# EAGLE design EPS Flatsat Module2 (EAGLE 9.2.0)

## Sheet 1 of 3
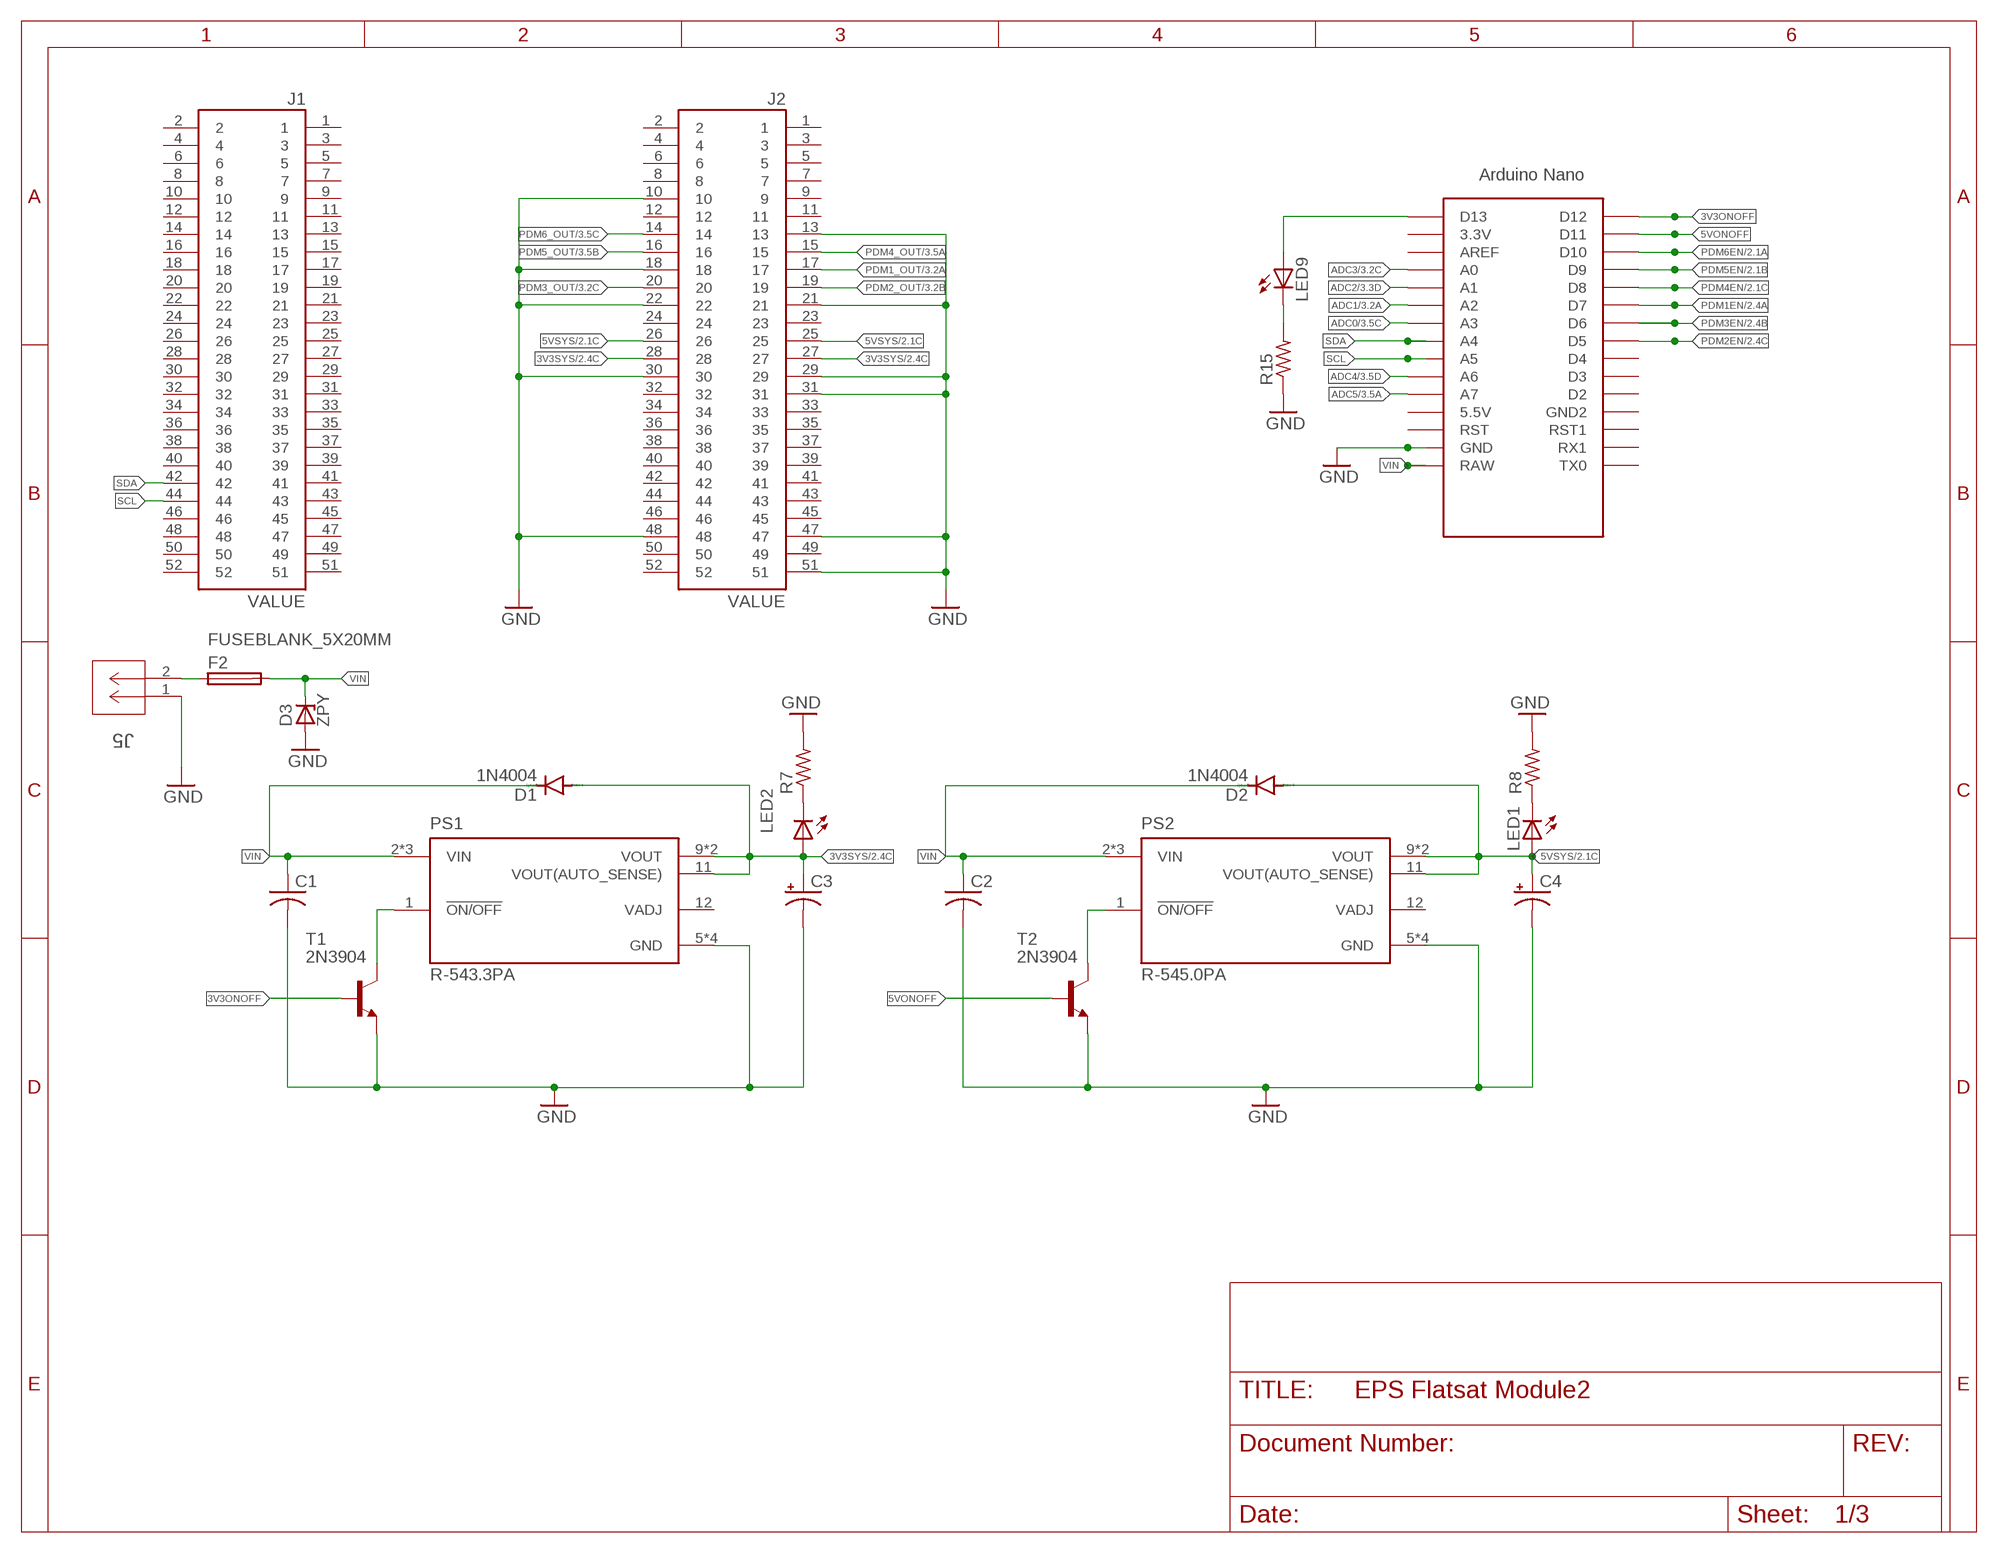
[diagram p0: schematic, sheet 1]

### Parts
C1  C-USC0805  [C0805]
C2  C-USC0805  [C0805]
C3  CPOL-USE2.5-6  [E2,5-6]
C4  CPOL-USE2.5-6  [E2,5-6]
D1  1N4004  [DO41-10]
D2  1N4004  [DO41-10]
D3  ZPY  [DO41Z10]
F2  FUSEBLANK_5X20MM  [FUSE_HOLDER_5X20MM]
J1  ESQ-126-39-G-D  [SAMTEC_ESQ-126-39-G-D]
J2  ESQ-126-39-G-D  [SAMTEC_ESQ-126-39-G-D]
J5  1985881  [CONN_1715022_PXC]
LED1  LEDCHIPLED_0805  [CHIPLED_0805]
LED2  LEDCHIPLED_0805  [CHIPLED_0805]
LED9  LEDCHIP-LED0805  [CHIP-LED0805]
PS1  R-543.3PA  [CONV_R-543.3PA]
PS2  R-545.0PA  [CONV_R-545.0PA]
R7  R-US_R0805  [R0805]
R8  R-US_R0805  [R0805]
R15  R-US_R0805  [R0805]
T1  2N3904  [TO92]
T2  2N3904  [TO92]
U$1  NANO  [NANO]

### Nets
3V3ONOFF: T1.2(B) U$1.D12
3V3SYS [power]: C3.+ D1.A J2.27 J2.28 LED2.A PS1.9(VOUT) PS1.10(VOUT) PS1.11(VOUT(AUTO_SENSE)) ; also sheet 2
5VONOFF: T2.2(B) U$1.D11
5VSYS [power]: C4.+ D2.A J2.25 J2.26 LED1.A PS2.9(VOUT) PS2.10(VOUT) PS2.11(VOUT(AUTO_SENSE)) ; also sheet 2
ADC0: U$1.A3 ; also sheet 3
ADC1: U$1.A2 ; also sheet 3
ADC2: U$1.A1 ; also sheet 3
ADC3: U$1.A0 ; also sheet 3
ADC4: U$1.A6 ; also sheet 3
ADC5: U$1.A7 ; also sheet 3
GND [power]: C1.2 C2.2 C3.- C4.- D3.A J2.10 J2.13 J2.18 J2.21 J2.22 J2.29 J2.30 J2.31 J2.47 J2.48 J2.51 J5.1 PS1.5(GND) PS1.6(GND) PS1.7(GND) PS1.8(GND) PS2.5(GND) PS2.6(GND) PS2.7(GND) PS2.8(GND) R7.2 R8.2 R15.1 T1.3(E) T2.3(E) U$1.GND ; also sheet 2,3
N$1: PS1.1(!ON/OFF) T1.1(C)
N$2: PS2.1(!ON/OFF) T2.1(C)
N$9: LED1.C R8.1
N$10: LED2.C R7.1
N$17 [power]: F2.1 J5.2
N$18: LED9.A U$1.D13
N$27: LED9.C R15.2
PDM1_OUT: J2.17 ; also sheet 3
PDM1EN: U$1.D7 ; also sheet 2
PDM2_OUT: J2.19 ; also sheet 3
PDM2EN: U$1.D5 ; also sheet 2
PDM3_OUT: J2.20 ; also sheet 3
PDM3EN: U$1.D6 ; also sheet 2
PDM4_OUT: J2.15 ; also sheet 3
PDM4EN: U$1.D8 ; also sheet 2
PDM5_OUT: J2.16 ; also sheet 3
PDM5EN: U$1.D9 ; also sheet 2
PDM6_OUT: J2.14 ; also sheet 3
PDM6EN: U$1.D10 ; also sheet 2
SCL: J1.44 U$1.A5
SDA: J1.42 U$1.A4
VIN [power]: C1.1 C2.1 D1.C D2.C D3.C F2.2 PS1.2(VIN) PS1.3(VIN) PS1.4(VIN) PS2.2(VIN) PS2.3(VIN) PS2.4(VIN) U$1.RAW
Unconnected: J1.1 J1.2 J1.3 J1.4 J1.5 J1.6 J1.7 J1.8 J1.9 J1.10 J1.11 J1.12 J1.13 J1.14 J1.15 J1.16 J1.17 J1.18 J1.19 J1.20 J1.21 J1.22 J1.23 J1.24 J1.25 J1.26 J1.27 J1.28 J1.29 J1.30 J1.31 J1.32 J1.33 J1.34 J1.35 J1.36 J1.37 J1.38 J1.39 J1.40 J1.41 J1.43 J1.45 J1.46 J1.47 J1.48 J1.49 J1.50 J1.51 J1.52 J2.1 J2.2 J2.3 J2.4 J2.5 J2.6 J2.7 J2.8 J2.9 J2.11 J2.12 J2.23 J2.24 J2.32 J2.33 J2.34 J2.35 J2.36 J2.37 J2.38 J2.39 J2.40 J2.41 J2.42 J2.43 J2.44 J2.45 J2.46 J2.49 J2.50 J2.52 PS1.12(VADJ) PS2.12(VADJ) U$1.3.3V U$1.5V(5.5V) U$1.AREF U$1.D2 U$1.D3 U$1.D4 U$1.GND1(GND2) U$1.ICSP1 U$1.ICSP2 U$1.ICSP3 U$1.ICSP4 U$1.ICSP5 U$1.ICSP6 U$1.RST U$1.RST1 U$1.RX1 U$1.TX0

## Sheet 2 of 3
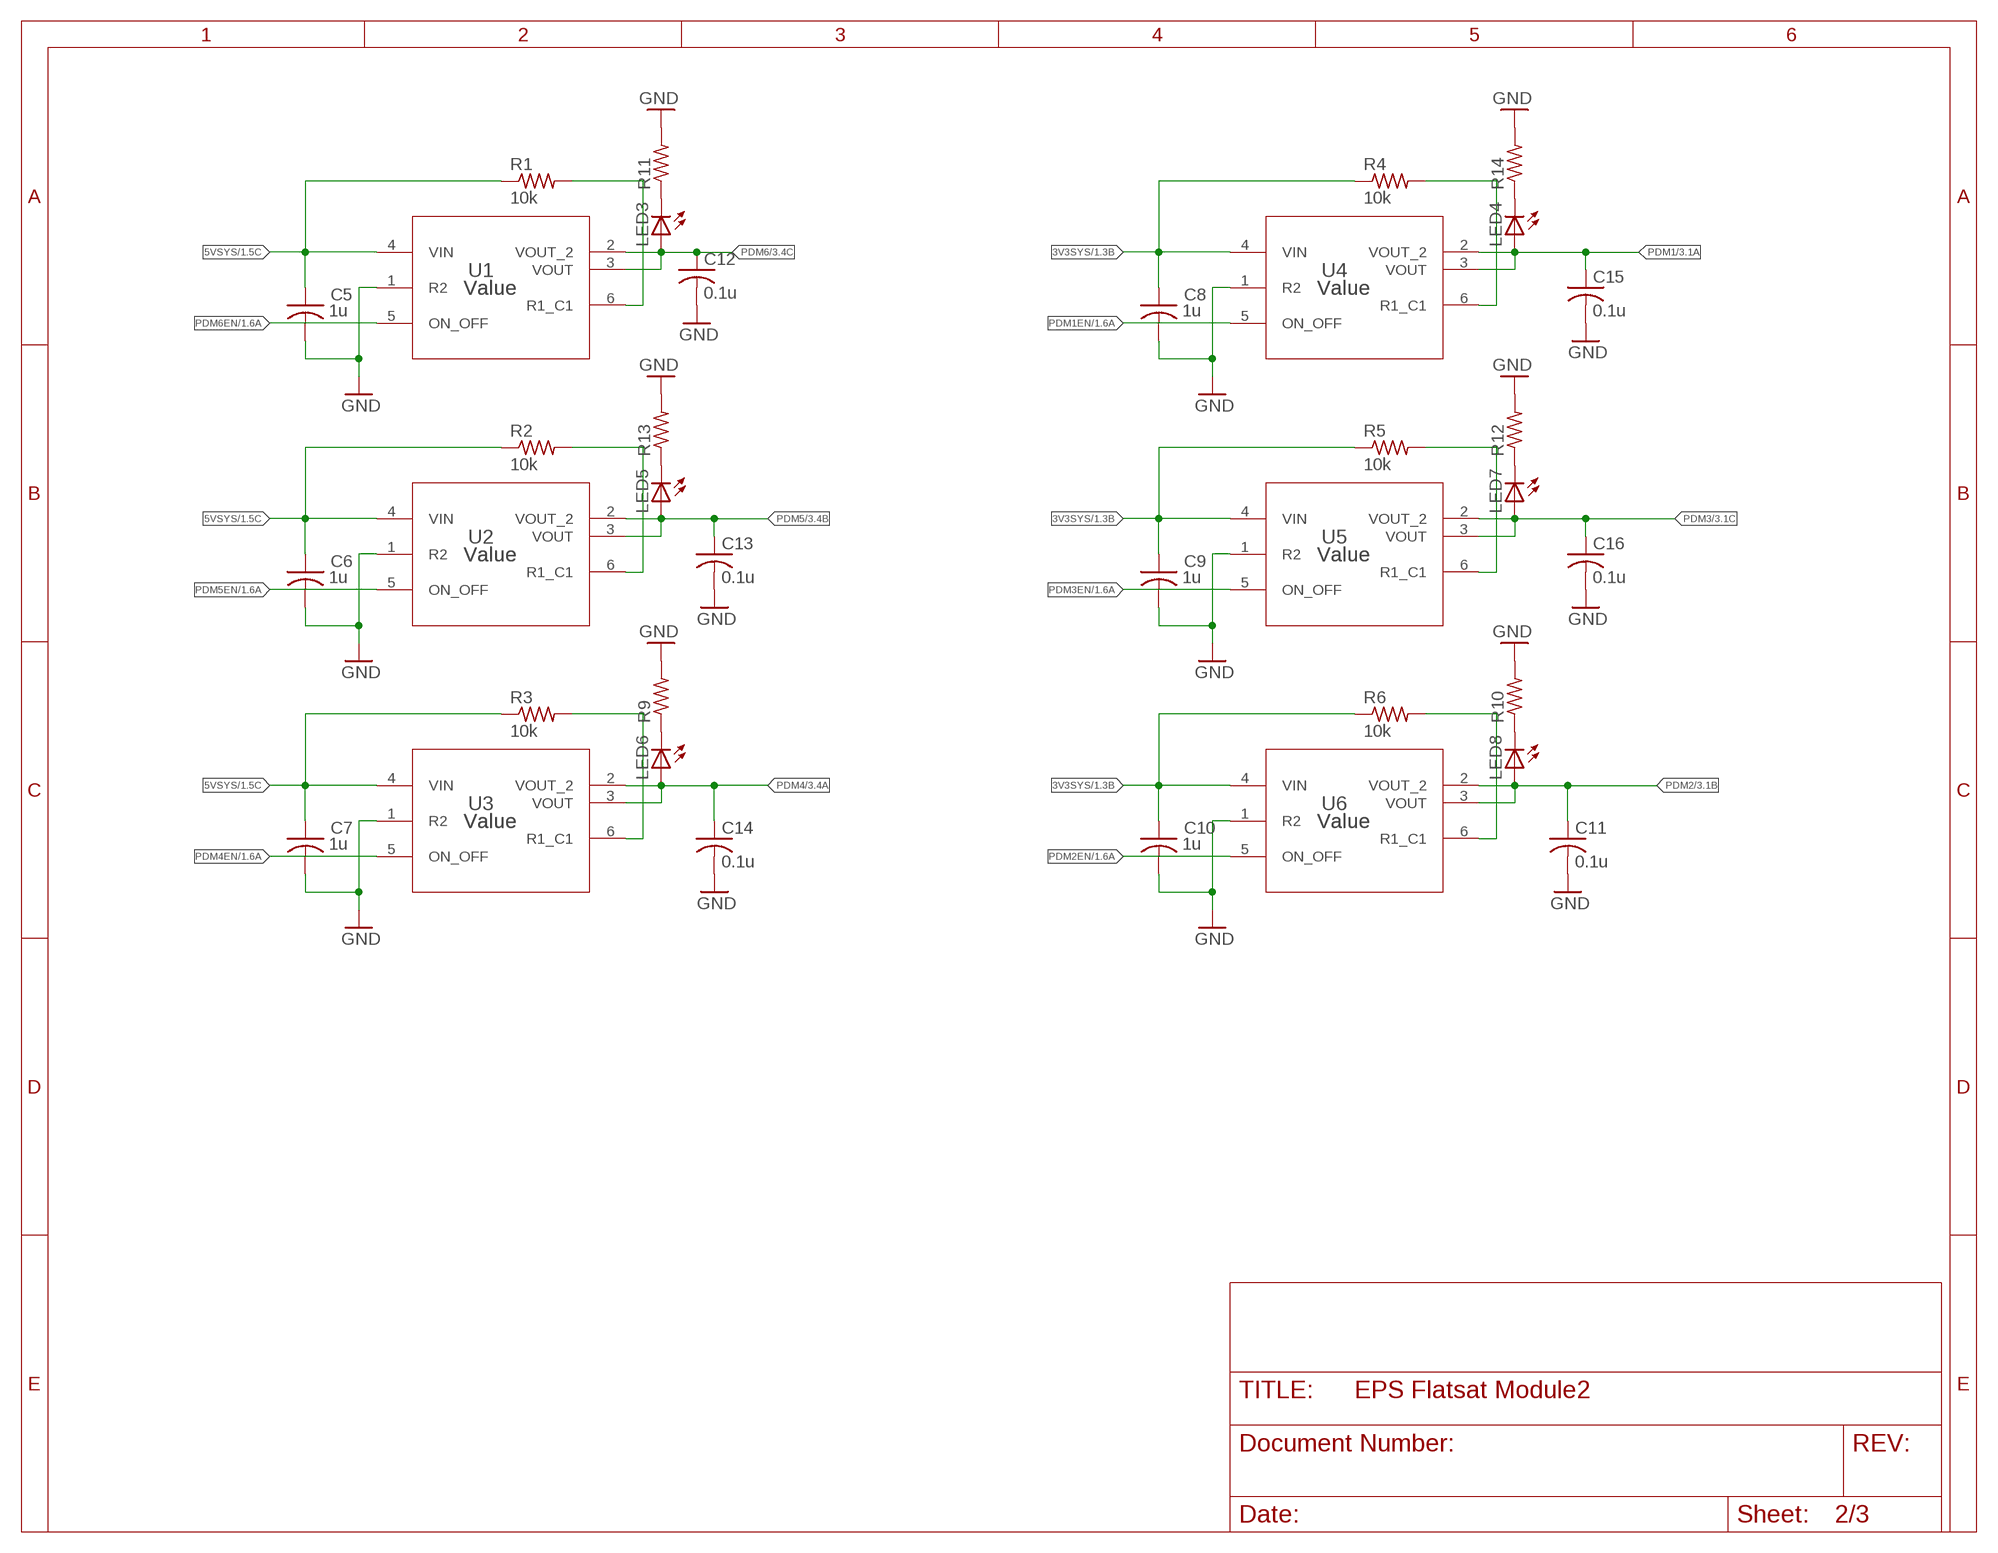
[diagram p1: schematic, sheet 2]

### Parts
C5  1u  C-USC0805  [C0805]
C6  1u  C-USC0805  [C0805]
C7  1u  C-USC0805  [C0805]
C8  1u  C-USC0805  [C0805]
C9  1u  C-USC0805  [C0805]
C10  1u  C-USC0805  [C0805]
C11  0.1u  C-USC0805  [C0805]
C12  0.1u  C-USC0805  [C0805]
C13  0.1u  C-USC0805  [C0805]
C14  0.1u  C-USC0805  [C0805]
C15  0.1u  C-USC0805  [C0805]
C16  0.1u  C-USC0805  [C0805]
LED3  LEDCHIPLED_0805  [CHIPLED_0805]
LED4  LEDCHIPLED_0805  [CHIPLED_0805]
LED5  LEDCHIPLED_0805  [CHIPLED_0805]
LED6  LEDCHIPLED_0805  [CHIPLED_0805]
LED7  LEDCHIPLED_0805  [CHIPLED_0805]
LED8  LEDCHIPLED_0805  [CHIPLED_0805]
R1  10k  R-US_R0805  [R0805]
R2  10k  R-US_R0805  [R0805]
R3  10k  R-US_R0805  [R0805]
R4  10k  R-US_R0805  [R0805]
R5  10k  R-US_R0805  [R0805]
R6  10k  R-US_R0805  [R0805]
R9  R-US_R0805  [R0805]
R10  R-US_R0805  [R0805]
R11  R-US_R0805  [R0805]
R12  R-US_R0805  [R0805]
R13  R-US_R0805  [R0805]
R14  R-US_R0805  [R0805]
U1  Value  TPS27081ADDCR  [DDC0006A_N]
U2  Value  TPS27081ADDCR  [DDC0006A_N]
U3  Value  TPS27081ADDCR  [DDC0006A_N]
U4  Value  TPS27081ADDCR  [DDC0006A_N]
U5  Value  TPS27081ADDCR  [DDC0006A_N]
U6  Value  TPS27081ADDCR  [DDC0006A_N]

### Nets
3V3SYS [power]: C8.1 C9.1 C10.1 R4.1 R5.1 R6.1 U4.4(VIN) U5.4(VIN) U6.4(VIN) ; also sheet 1
5VSYS [power]: C5.1 C6.1 C7.1 R1.1 R2.1 R3.1 U1.4(VIN) U2.4(VIN) U3.4(VIN) ; also sheet 1
GND [power]: C5.2 C6.2 C7.2 C8.2 C9.2 C10.2 C11.2 C12.2 C13.2 C14.2 C15.2 C16.2 R9.2 R10.2 R11.2 R12.2 R13.2 R14.2 U1.1(R2) U2.1(R2) U3.1(R2) U4.1(R2) U5.1(R2) U6.1(R2) ; also sheet 1,3
N$3: R1.2 U1.6(R1_C1)
N$4: R2.2 U2.6(R1_C1)
N$5: R3.2 U3.6(R1_C1)
N$6: R4.2 U4.6(R1_C1)
N$7: R5.2 U5.6(R1_C1)
N$8: R6.2 U6.6(R1_C1)
N$11: LED6.C R9.1
N$12: LED3.C R11.1
N$13: LED4.C R14.1
N$14: LED7.C R12.1
N$15: LED5.C R13.1
N$16: LED8.C R10.1
PDM1 [power]: C15.1 LED4.A U4.2(VOUT_2) U4.3(VOUT) ; also sheet 3
PDM1EN: U4.5(ON_OFF) ; also sheet 1
PDM2 [power]: C11.1 LED8.A U6.2(VOUT_2) U6.3(VOUT) ; also sheet 3
PDM2EN: U6.5(ON_OFF) ; also sheet 1
PDM3 [power]: C16.1 LED7.A U5.2(VOUT_2) U5.3(VOUT) ; also sheet 3
PDM3EN: U5.5(ON_OFF) ; also sheet 1
PDM4 [power]: C14.1 LED6.A U3.2(VOUT_2) U3.3(VOUT) ; also sheet 3
PDM4EN: U3.5(ON_OFF) ; also sheet 1
PDM5 [power]: C13.1 LED5.A U2.2(VOUT_2) U2.3(VOUT) ; also sheet 3
PDM5EN: U2.5(ON_OFF) ; also sheet 1
PDM6 [power]: C12.1 LED3.A U1.2(VOUT_2) U1.3(VOUT) ; also sheet 3
PDM6EN: U1.5(ON_OFF) ; also sheet 1

## Sheet 3 of 3
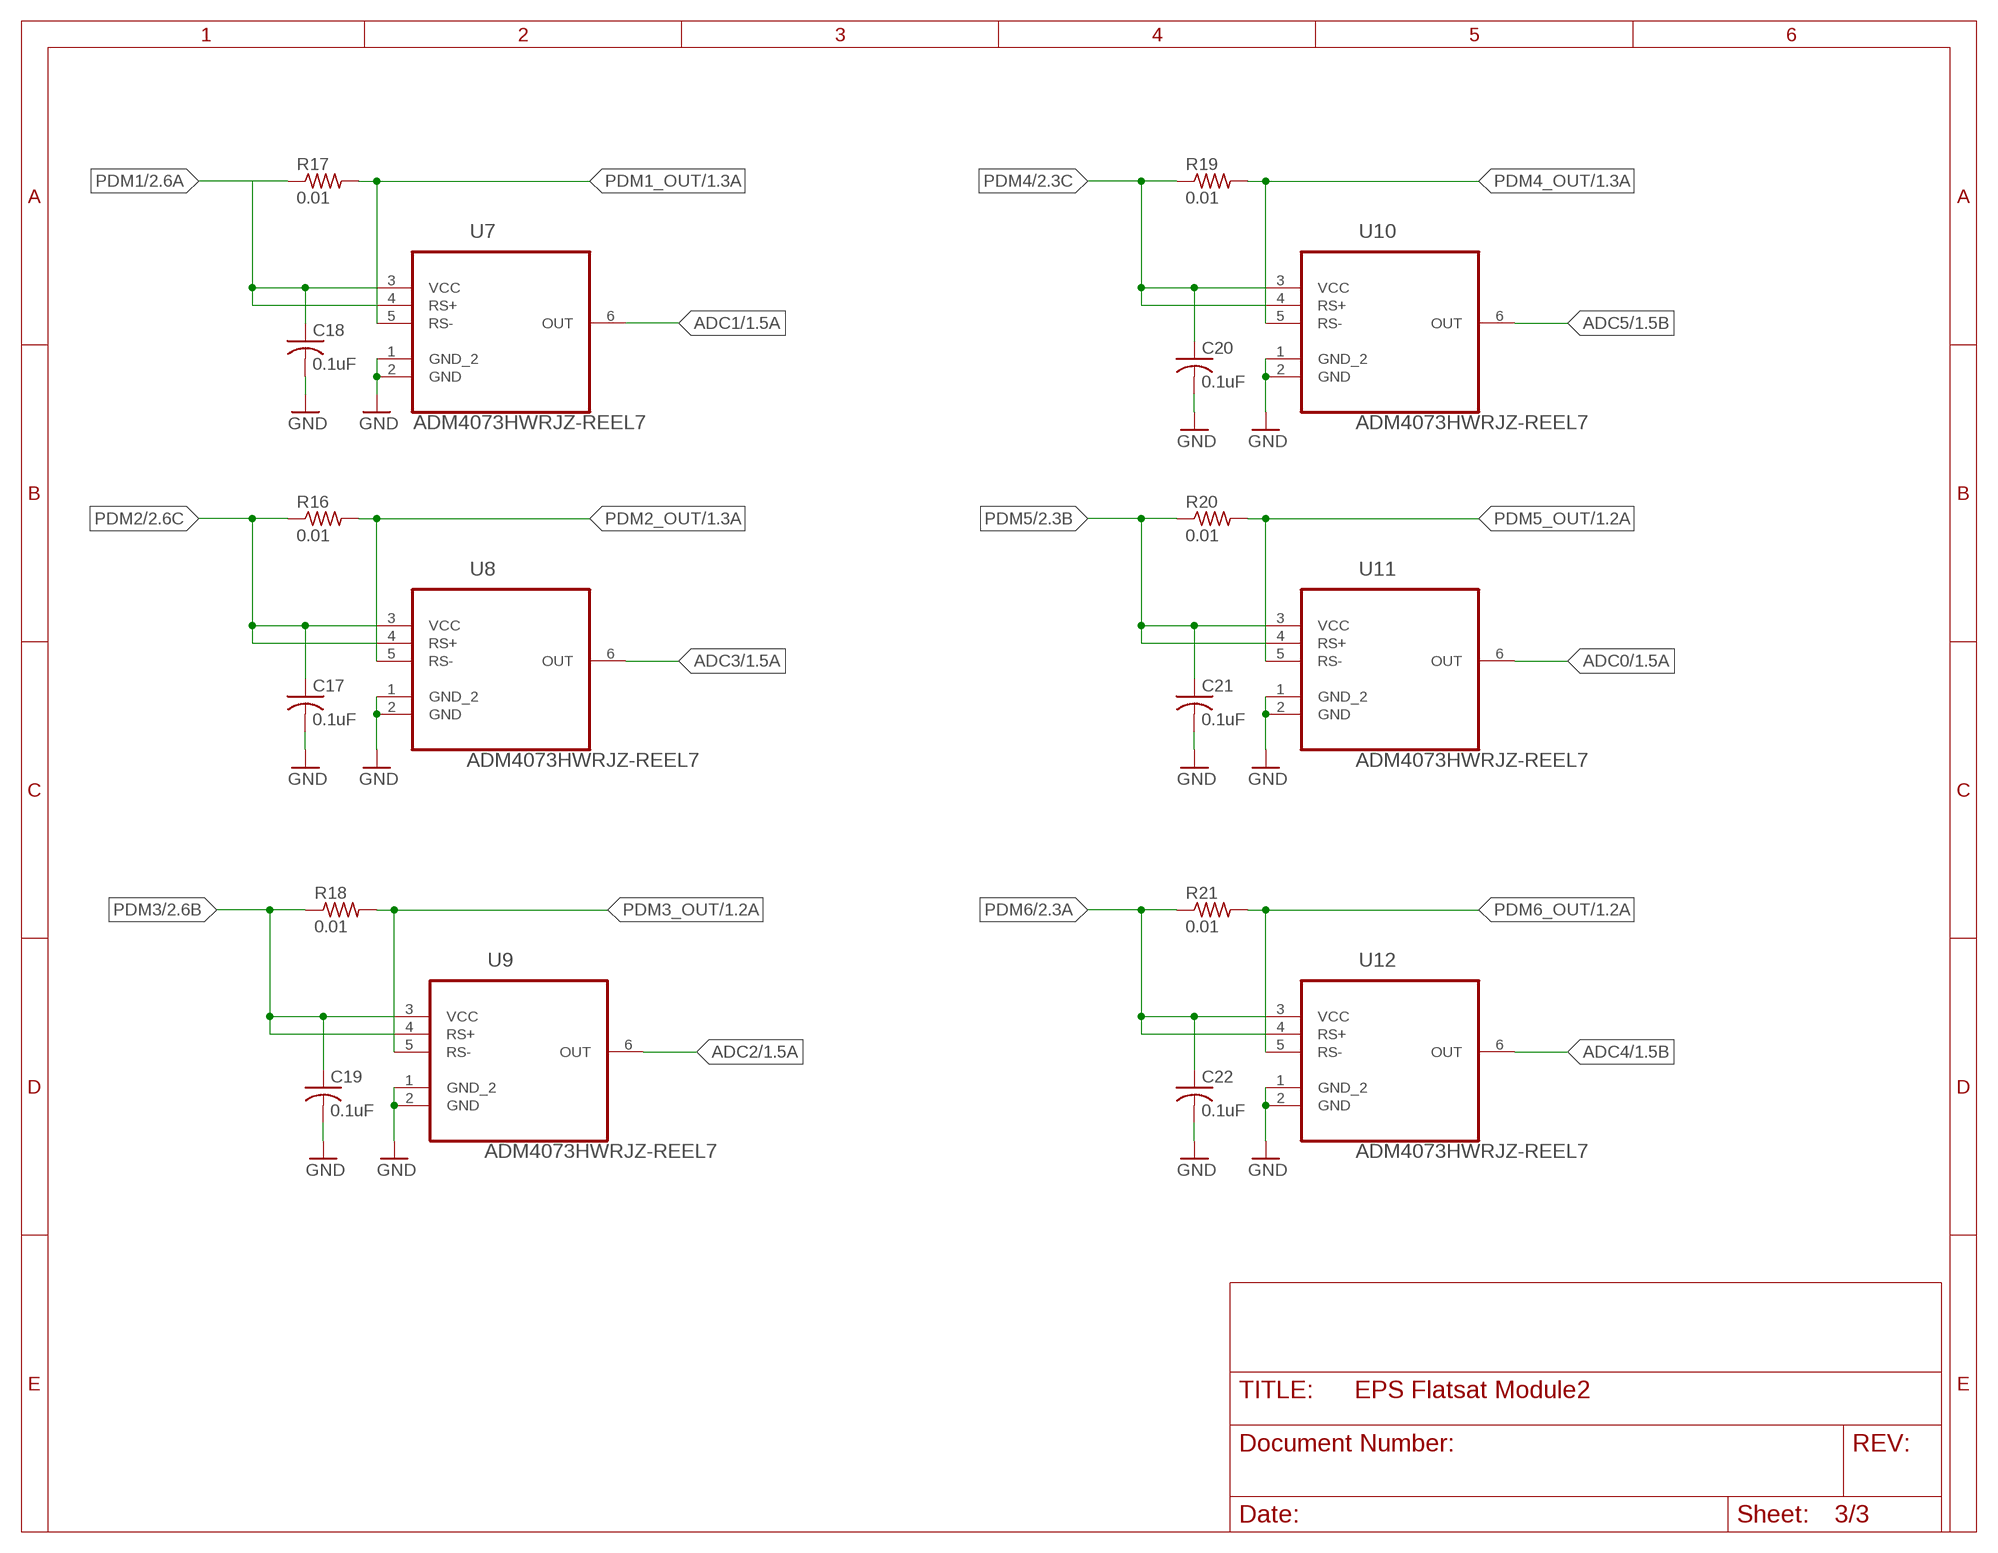
[diagram p2: schematic, sheet 3]

### Parts
C17  0.1uF  C-USC0805  [C0805]
C18  0.1uF  C-USC0805  [C0805]
C19  0.1uF  C-USC0805  [C0805]
C20  0.1uF  C-USC0805  [C0805]
C21  0.1uF  C-USC0805  [C0805]
C22  0.1uF  C-USC0805  [C0805]
R16  0.01  R-US_R2512  [R2512]
R17  0.01  R-US_R2512  [R2512]
R18  0.01  R-US_R2512  [R2512]
R19  0.01  R-US_R2512  [R2512]
R20  0.01  R-US_R2512  [R2512]
R21  0.01  R-US_R2512  [R2512]
U7  ADM4073HWRJZ-REEL7  [SOT95P290X145-6N]
U8  ADM4073HWRJZ-REEL7  [SOT95P290X145-6N]
U9  ADM4073HWRJZ-REEL7  [SOT95P290X145-6N]
U10  ADM4073HWRJZ-REEL7  [SOT95P290X145-6N]
U11  ADM4073HWRJZ-REEL7  [SOT95P290X145-6N]
U12  ADM4073HWRJZ-REEL7  [SOT95P290X145-6N]

### Nets
ADC0: U11.6(OUT) ; also sheet 1
ADC1: U7.6(OUT) ; also sheet 1
ADC2: U9.6(OUT) ; also sheet 1
ADC3: U8.6(OUT) ; also sheet 1
ADC4: U12.6(OUT) ; also sheet 1
ADC5: U10.6(OUT) ; also sheet 1
GND [power]: C17.2 C18.2 C19.2 C20.2 C21.2 C22.2 U7.1(GND_2) U7.2(GND) U8.1(GND_2) U8.2(GND) U9.1(GND_2) U9.2(GND) U10.1(GND_2) U10.2(GND) U11.1(GND_2) U11.2(GND) U12.1(GND_2) U12.2(GND) ; also sheet 1,2
PDM1 [power]: C18.1 R17.1 U7.3(VCC) U7.4(RS+) ; also sheet 2
PDM1_OUT: R17.2 U7.5(RS-) ; also sheet 1
PDM2 [power]: C17.1 R16.1 U8.3(VCC) U8.4(RS+) ; also sheet 2
PDM2_OUT: R16.2 U8.5(RS-) ; also sheet 1
PDM3 [power]: C19.1 R18.1 U9.3(VCC) U9.4(RS+) ; also sheet 2
PDM3_OUT: R18.2 U9.5(RS-) ; also sheet 1
PDM4 [power]: C20.1 R19.1 U10.3(VCC) U10.4(RS+) ; also sheet 2
PDM4_OUT: R19.2 U10.5(RS-) ; also sheet 1
PDM5 [power]: C21.1 R20.1 U11.3(VCC) U11.4(RS+) ; also sheet 2
PDM5_OUT: R20.2 U11.5(RS-) ; also sheet 1
PDM6 [power]: C22.1 R21.1 U12.3(VCC) U12.4(RS+) ; also sheet 2
PDM6_OUT: R21.2 U12.5(RS-) ; also sheet 1

## Library data of the parts
C1 C2 C5-C22 = rcl:C-US: CAPACITOR, American symbol; SPICEPREFIX: C
C3 C4 = rcl:CPOL-US: POLARIZED CAPACITOR, American symbol; SPICEPREFIX: C
D1 D2 = diode:1N4004: DIODE general purpose rectifier, 1 A
D3 = diode:ZPY: Z DIODE 1 W
F2 = fuse:FUSE: Fuse; OC_FARNELL: unknown; OC_NEWARK: unknown
J1 J2 = ESQ-126-39-G-D:ESQ-126-39-G-D: Conn Elevated Socket SKT 52 POS 2.54mm Solder ST Thru-Hole Tube; DESCRIPTION: 52 Position Elevated Socket Connector Through Hole; DIGI-KEY_PART_NUMBER: SAM10462-ND; DIGI-KEY_PURCHASE_URL: https://www.digikey.com/product-detail/en/samtec-inc/ESQ-126-39-G-D/SAM10462-ND/3601055?utm_source=snapeda&utm_medium=aggregator&utm_campaign=symbol; MF: Samtec; MP: ESQ-126-39-G-D; PACKAGE: None
J5 = 1985881:1985881; ARTICLE_DESCRIPTION: MKDS 1,5/ 2 HT BK; BUILT_BY: EMA_Matt; CONTACT_TYPE: Unknown; COPYRIGHT: Copyright (C) 2018 Accelerated Designs. All rights reserved; MANUFACTURER_PART_NUMBER: 1985881; NUMBER_OF_CONNECTION: 2; NUMBER_OF_POSITION_PER_ROW: 2; NUMBER_OF_POTENTIALS: 2; NUMBER_OF_ROWS: 1; NUMBER_OF_SOLDER_PINS_PER_POTENTIALS: 1; PITCH__MM_: 5; PLUG_SYSTEM: Unknown; PRODUCTTYP: Printed circuit board terminal; PRODUCT_FAMILY: MKDS 1,5/..-HT; SOLDER_PIN_LENGTH__MM_: 3.5; SOURCELIBRARY: Phoenix_Contact_2020-03-19; VENDOR: Phoenix Contact
LED1-LED9 = led:LED: LED OSRAM: - CHIPLED LG R971, LG N971, LY N971, LG Q971, LY Q971, LO R971, LY R971 LH N974, LH R974 LS Q976, LO Q976, LY Q976 LO Q996 - Hyper CHIPLED LW Q18S LB Q993, LB Q99A, LB R99A - SideLED LS A670, LO A670, LY A670, LG A670, LP A670 LB A673, LV A673, LT A673, LW A673 LH A674 LY A675 LS A676, LA A676, LO A676, LY A676, LW A676 LS A679, LY A679, LG A679 - Hyper Micro SIDELED® LS Y876, LA Y876, LO Y876, LY Y876 LT Y87S - SmartLED LW L88C, LW L88S LB L89C, LB L89S, LG L890 LS L89K, LO L89K, LY L89K LS L896, LA L896, LO L896, LY L896 - TOPLED LS T670, LO T670, LY T670, LG T670, LP T670 LSG T670, LSP T670, LSY T670, LOP T670, LYG T670 LG T671, LOG T671, LSG T671 LB T673, LV T673, LT T673, LW T673 LH T674 LS T676, LA T676, LO T676, LY T676, LB T676, LH T676, LSB T676, LW T676 LB T67C, LV T67C, LT T67C, LS T67K, LO T67K, LY T67K, LW E67C LS E67B, LA E67B, LO E67B, LY E67B, LB E67C, LV E67C, LT E67C LW T67C LS T679, LY T679, LG T679 LS T770, LO T770, LY T770, LG T770, LP T770 LB T773, LV T773, LT T773, LW T773 LH T774 LS E675, LA E675, LY E675, LS T675 LS T776, LA T776, LO T776, LY T776, LB T776 LHGB T686 LT T68C, LB T68C - Hyper Mini TOPLED® LB M676 - Mini TOPLED Santana® LG M470 LS M47K, LO M47K, LY M47K Source: http://www.osram.convergy.de LUXEON: - LUMILED® LXK2-PW12-R00, LXK2-PW12-S00, LXK2-PW14-U00, LXK2-PW14-V00 LXK2-PM12-R00, LXK2-PM12-S00, LXK2-PM14-U00 LXK2-PE12-Q00, LXK2-PE12-R00, LXK2-PE12-S00, LXK2-PE14-T00, LXK2-PE14-U00 LXK2-PB12-K00, LXK2-PB12-L00, LXK2-PB12-M00, LXK2-PB14-N00, LXK2-PB14-P00, LXK2-PB14-Q00 LXK2-PR12-L00, LXK2-PR12-M00, LXK2-PR14-Q00, LXK2-PR14-R00 LXK2-PD12-Q00, LXK2-PD12-R00, LXK2-PD12-S00 LXK2-PH12-R00, LXK2-PH12-S00 LXK2-PL12-P00, LXK2-PL12-Q00, LXK2-PL12-R00 Source: www.luxeon.com KINGBRIGHT: KA-3528ASYC Source: www.kingbright.com
PS1 = R-543.3PA:R-543.3PA: 2,3,4,5 Amp SIP12 Vertical & Horizontal Single Output; DESCRIPTION: 4A DC/DC-Converter 'INNOLINE' SIP12 reg; DIGI-KEY_PART_NUMBER: 945-1599-5-ND; DIGIKEY-PURCHASE-URL: https://snapeda.com/shop?store=DigiKey&id=3630570; MF: Recom Power; MP: R-543.3PA; PACKAGE: SIP-12 Recom Power
PS2 = R-545.0PA:R-545.0PA: 2,3,4,5 Amp SIP12 Vertical & Horizontal Single Output; DESCRIPTION: 4A DC/DC-Converter 'INNOLINE' SIP12 reg; DIGI-KEY_PART_NUMBER: R-545.0PA-ND; MF: Recom Power; MP: R-545.0PA; PACKAGE: SIP-12 Recom Power
R1-R21 = rcl:R-US_: RESISTOR, American symbol; SPICEPREFIX: R
T1 T2 = transistor:2N3904: NPN TRANSISTOR
U1-U6 = TPS27081ADDCR:TPS27081ADDCR; APPLICATION_BUILDNUMBER: *; COMPTYPE: IC; MANUFACTURER: Texas Instruments; MOUNTTYPE: SMT; PACKAGEREFERENCE: DDC0006A; PARTNUMBER: TPS27081ADDCR; PIN_COUNT: 6; REFDES: RefDes; ROHS: Y; TYPE: TYPE
U7-U12 = ADM4073HWRJZ-REEL7:ADM4073HWRJZ-REEL7: Low Cost, Voltage Output, High-side Current Sense Amplifier; DESCRIPTION: Current Sense Amplifier 1 Circuit SOT-23-6; DIGI-KEY_PART_NUMBER: ADM4073HWRJZ-REEL7CT-ND; MF: Analog Devices; MP: ADM4073HWRJZ-REEL7; PACKAGE: SOT-6 Analog Devices; PURCHASE-URL: https://pricing.snapeda.com/search/part/ADM4073HWRJZ-REEL7/?ref=eda
U$1 = Arduino-clone:NANO: Arduino Nano

## Net classes
0 default: width 0.19 mm, drill 0.19 mm
1 power: width 0.203 mm

## Board
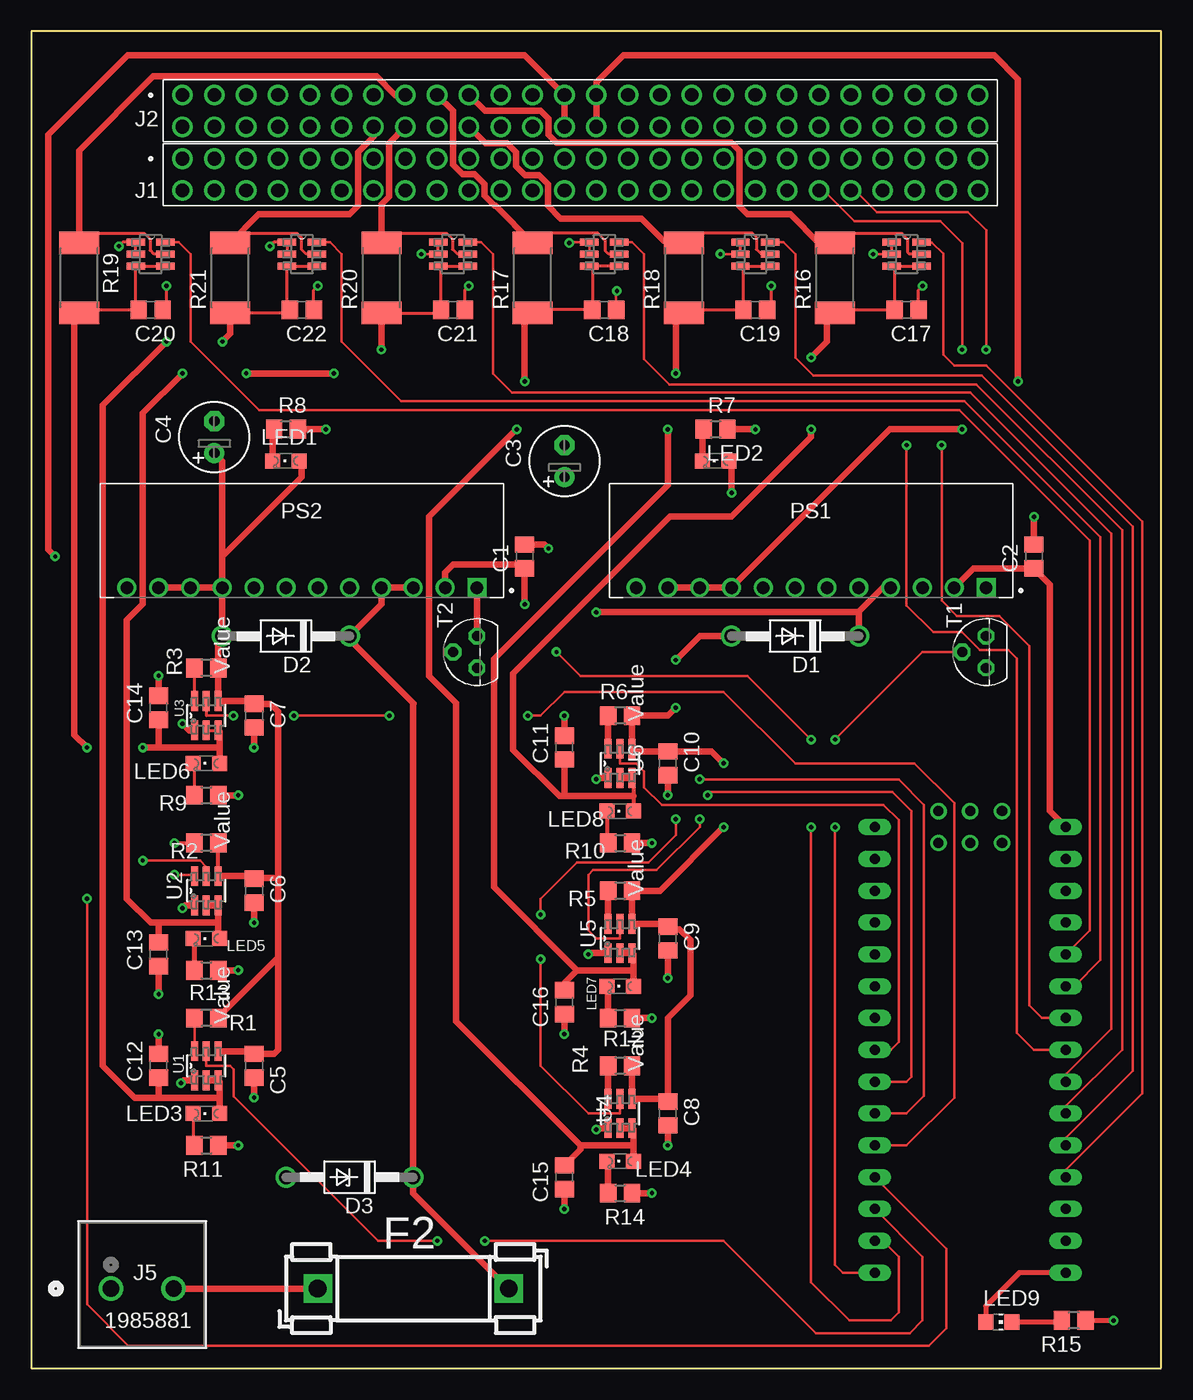
[diagram p3: board, top side]
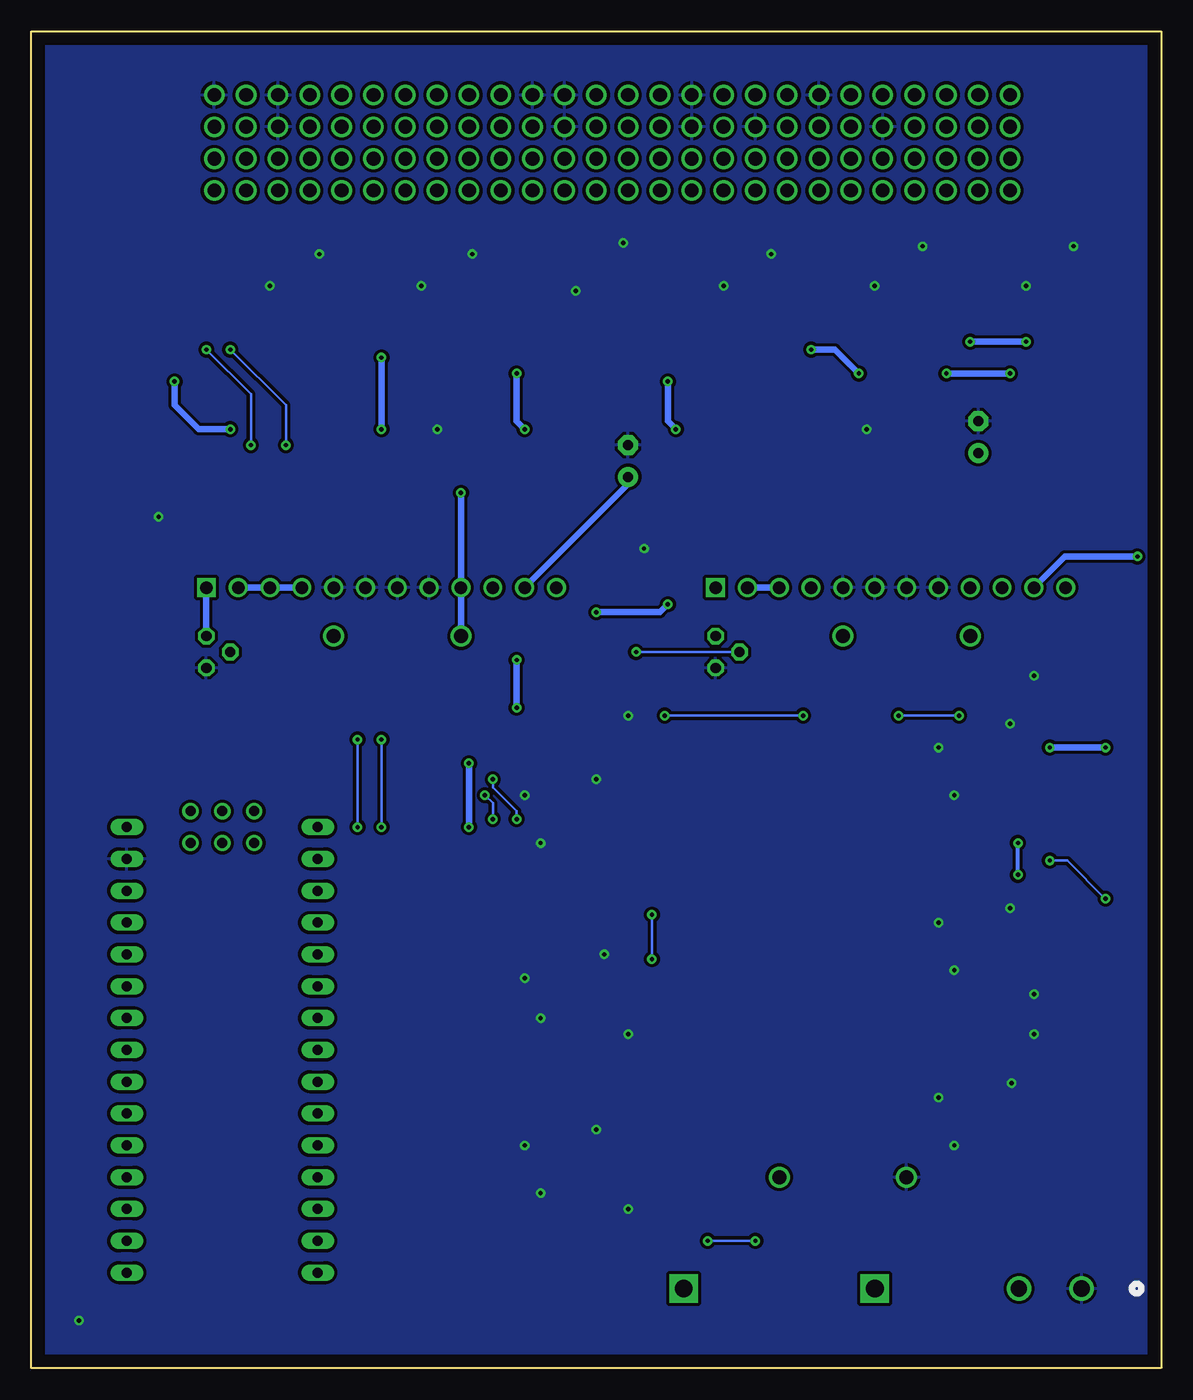
[diagram p4: board, bottom side, seen from below]

Size 90.17 x 106.68 mm. Coordinates in mm from the lower left corner, seen from the top.
Outline: 0,106.68 0,0 90.17,0 90.17,106.68 0,106.68
Copper layers (1*16): Top 0.035mm / dielectric 1.5mm / Bottom 0.035mm
Design rules "default": minimum track width 6mil, minimum drill 0.35mm, track to track 6mil, track to pad 6mil, pad to pad 6mil, via to via 6mil, smd to smd 6mil, copper to edge 40mil, drill to drill 6mil, minimum pad ring 10mil, minimum via ring 8mil, stop-mask expansion 4mil, vias tented up to drill 0mil, thermal gap 10mil

### Footprints (pad centres in the part's own frame; a part is rotated, then mirrored left to right if it is on the bottom)
C0805 = smd 1.3 x 1.5: 1 -0.95,0; 2 0.95,0
E2,5-6 = drill 0.813 pad 1.6: + -1.27,0 | drill 0.813 pad 1.6 octagon: - 1.27,0
DO41-10 = drill 1.118: A 5.08,0; C -5.08,0
DO41Z10 = drill 1.118: A 5.08,0; C -5.08,0
FUSE_HOLDER_5X20MM = drill 1.422 pad 2.286 square: 1 0,0; 2 15.24,0
SAMTEC_ESQ-126-39-G-D = drill 1.1: 1 0,0; 2 0,-2.54; 3 2.54,0; 4 2.54,-2.54; 5 5.08,0; 6 5.08,-2.54; 7 7.62,0; 8 7.62,-2.54; 9 10.16,0; 10 10.16,-2.54; 11 12.7,0; 12 12.7,-2.54; 13 15.24,0; 14 15.24,-2.54; 15 17.78,0; 16 17.78,-2.54; 17 20.32,0; 18 20.32,-2.54; 19 22.86,0; 20 22.86,-2.54; 21 25.4,0; 22 25.4,-2.54; 23 27.94,0; 24 27.94,-2.54; 25 30.48,0; 26 30.48,-2.54; 27 33.02,0; 28 33.02,-2.54; 29 35.56,0; 30 35.56,-2.54; 31 38.1,0; 32 38.1,-2.54; 33 40.64,0; 34 40.64,-2.54; 35 43.18,0; 36 43.18,-2.54; 37 45.72,0; 38 45.72,-2.54; 39 48.26,0; 40 48.26,-2.54; 41 50.8,0; 42 50.8,-2.54; 43 53.34,0; 44 53.34,-2.54; 45 55.88,0; 46 55.88,-2.54; 47 58.42,0; 48 58.42,-2.54; 49 60.96,0; 50 60.96,-2.54; 51 63.5,0; 52 63.5,-2.54
CONN_1715022_PXC = drill 1.295 pad 1.803: 1 0,0; 2 5.004,0
CHIPLED_0805 = smd 1.2 x 1.2: A 0,-1.05; C 0,1.05
CHIP-LED0805 = smd 1.2 x 1.2: A 0,-1.05; C 0,1.05
CONV_R-543.3PA = drill 1 square: 1 -13.97,3.75 | drill 1: 2 -11.43,3.75; 3 -8.89,3.75; 4 -6.35,3.75; 5 -3.81,3.75; 6 -1.27,3.75; 7 1.27,3.75; 8 3.81,3.75; 9 6.35,3.75; 10 8.89,3.75; 11 11.43,3.75; 12 13.97,3.75
CONV_R-545.0PA = drill 1 square: 1 -13.97,3.75 | drill 1: 2 -11.43,3.75; 3 -8.89,3.75; 4 -6.35,3.75; 5 -3.81,3.75; 6 -1.27,3.75; 7 1.27,3.75; 8 3.81,3.75; 9 6.35,3.75; 10 8.89,3.75; 11 11.43,3.75; 12 13.97,3.75
R0805 = smd 1.3 x 1.5: 1 -0.95,0; 2 0.95,0
R2512 = smd 1.8 x 3.2: 1 -2.8,0; 2 2.8,0
TO92 = drill 0.813 octagon: 1 1.27,0; 2 0,1.905; 3 -1.27,0
DDC0006A_N = smd 1.575 x 0.559: 1 -1.168,0.95; 2 -1.168,0; 3 -1.168,-0.95; 4 1.168,-0.95; 5 1.168,0; 6 1.168,0.95
SOT95P290X145-6N = smd 1.473 x 0.559: 1 -1.194,0.94; 2 -1.194,0; 3 -1.194,-0.94; 4 1.194,-0.94; 5 1.194,0; 6 1.194,0.94
NANO = drill 0.8 long: 3.3V -10.16,24.13; 5V -10.16,-1.27; A0 -10.16,19.05; A1 -10.16,16.51; A2 -10.16,13.97; A3 -10.16,11.43; A4 -10.16,8.89; A5 -10.16,6.35; A6 -10.16,3.81; A7 -10.16,1.27; AREF -10.16,21.59; D2 5.08,1.27; D3 5.08,3.81; D4 5.08,6.35; D5 5.08,8.89; D6 5.08,11.43; D7 5.08,13.97; D8 5.08,16.51; D9 5.08,19.05; D10 5.08,21.59; D11 5.08,24.13; D12 5.08,26.67; D13 -10.16,26.67; GND -10.16,-6.35; GND1 5.08,-1.27; RAW -10.16,-8.89; RST -10.16,-3.81; RST1 5.08,-3.81; RX1 5.08,-6.35; TX0 5.08,-8.89 | drill 0.8: ICSP1 -5.08,-10.16; ICSP2 -5.08,-7.62; ICSP3 -2.54,-10.16; ICSP4 -2.54,-7.62; ICSP5 0,-10.16; ICSP6 0,-7.62

### Placement (x,y rotation side)
C1  39.37,64.77 90 top
C2  80.01,64.77 90 top
C3  42.55,72.39 90 top
C4  14.61,74.3 90 top
C5  17.78,24.13 270 top
C6  17.78,38.1 270 top
C7  17.78,52.07 270 top
C8  50.8,20.32 270 top
C9  50.8,34.29 270 top
C10  50.8,48.26 270 top
C11  42.55,49.53 90 top
C12  10.16,24.13 90 top
C13  10.16,33.02 270 top
C14  10.16,52.7 90 top
C15  42.55,15.24 270 top
C16  42.55,29.21 270 top
C17  69.85,84.45 0 top
C18  45.72,84.45 0 top
C19  57.78,84.45 0 top
C20  9.53,84.45 0 top
C21  33.66,84.45 0 top
C22  21.59,84.45 0 top
D1  60.96,58.42 180 top
D2  20.32,58.42 180 top
D3  25.4,15.24 180 top
F2  22.86,6.35 0 top
J1  12.06,96.52 0 top
J2  12.06,101.6 0 top
J5  6.35,6.35 0 top
LED1  20.32,72.39 90 top
LED2  54.61,72.39 90 top
LED3  13.97,20.32 90 top
LED4  46.99,16.51 90 top
LED5  13.97,34.29 90 top
LED6  13.97,48.26 90 top
LED7  46.99,30.48 90 top
LED8  46.99,44.45 90 top
LED9  77.22,3.68 270 top
PS1  62.23,66.04 180 top
PS2  21.59,66.04 180 top
R1  13.97,27.94 180 top
R2  13.97,41.91 180 top
R3  13.97,55.88 180 top
R4  46.99,24.13 180 top
R5  46.99,38.1 180 top
R6  46.99,52.07 180 top
R7  54.61,74.93 0 top
R8  20.32,74.93 0 top
R9  13.97,45.72 0 top
R10  46.99,41.91 0 top
R11  13.97,17.78 0 top
R12  46.99,27.94 0 top
R13  13.97,31.75 0 top
R14  46.99,13.97 0 top
R15  83.19,3.81 180 top
R16  64.14,87 90 top
R17  40.01,87 90 top
R18  52.07,87 90 top
R19  3.81,87 90 top
R20  27.94,87 90 top
R21  15.88,87 90 top
T1  76.2,57.15 90 top
T2  35.56,57.15 90 top
U1  13.97,24.13 90 top
U2  13.97,38.1 90 top
U3  13.97,52.07 90 top
U4  46.99,20.32 90 top
U5  46.99,34.29 90 top
U6  46.99,48.26 90 top
U7  45.72,88.9 0 top
U8  69.85,88.9 0 top
U9  57.78,88.9 0 top
U10  9.53,88.9 0 top
U11  33.66,88.9 0 top
U12  21.59,88.9 0 top
U$1  72.39,34.29 180 top

### Tracks (layer width: path | path; a pad name or v marks a point on that pad's centre or on a via)
3V3ONOFF  (via drill 0.35)
  Top 0.203: U$1.D12 64.77,7.62 64.14,8.26 v64.14,43.18 | v64.14,50.16 71.12,57.15 T1.2
  Bottom 0.203: v64.14,43.18 v64.14,50.16
3V3SYS  (via drill 0.35)
  Top 0.508: D1.A 53.34,58.42 v51.44,56.52 | R4.1 U4.4 50.58,21.49 C8.1 50.8,27.96 52.59,29.75 52.59,34.16 51.72,35.03 51.01,35.03 C9.1 50.58,35.46 U5.4 R5.1 50.16,38.1 v55.24,43.18 | v55.24,48.26 54.3,49.21 C10.1 48.16,49.21 U6.4 R6.1 50.8,52.07 v51.44,52.7 | PS1.11 PS1.10 PS1.9 68.52,74.93 v74.3,74.93 | J2.28 J2.27 45.09,102.62 47.24,104.78 76.83,104.78 78.74,102.87 v78.74,78.74 | v55.88,69.85 55.88,72.17 LED2.A
  Bottom 0.508: v55.24,48.26 v55.24,43.18 | D1.A PS1.9 v55.88,69.85 | v51.44,56.52 v51.44,52.7 | PS1.11 42.55,70.55 C3.+ | v78.74,78.74 78.74,76.83 76.83,74.93 v74.3,74.93
5VONOFF  (via drill 0.35)
  Top 0.203: v62.23,43.18 62.23,6.86 65.28,3.81 68.58,3.81 69.22,4.45 69.22,8.89 67.94,10.16 U$1.D11 | v62.23,50.16 57.15,55.24 43.81,55.24 v41.91,57.15
  Bottom 0.203: v62.23,50.16 v62.23,43.18 | v41.91,57.15 T2.2
5VSYS  (via drill 0.35)
  Top 0.203: 17.56,25.3 C5.1 | 14.89,27.97 R1.1 | 19.68,38.73 19.3,39.12 | 17.85,39.12 C6.1
  Top 0.254: 17.56,53.24 C7.1
  Top 0.305: U2.4 R2.1
  Top 0.508: U1.4 17.56,25.3 | 19.68,32.77 14.89,27.97 | 19.3,39.12 17.85,39.12 | 17.56,53.24 U3.4 R3.1 14.92,58.1 D2.A PS2.9 | C7.1 19.05,53.02 19.68,52.38 19.68,38.73 19.68,32.77 | U2.4 17.56,39.27 C6.1 | C5.1 19.36,25.08 19.68,25.4 19.68,32.77 | PS2.9 15.24,64.77 | 15.24,64.77 21.59,71.12 21.59,72.17 LED1.A | PS2.9 PS2.10 PS2.11 | C4.+ 15.24,72.39 15.24,64.77 | J2.26 J2.25 39.37,104.78 7.7,104.78 1.35,98.42 1.35,81.92 1.35,81.84 1.35,65.33 v1.91,64.77
  Bottom 0.508: PS2.11 7.68,64.77 v1.91,64.77
ADC0
  Top 0.203: U11.6 35.89,89.84 36.83,88.9 36.83,79.38 38.35,77.85 74.93,77.85 86.18,66.6 86.18,27.09 82.55,23.46 U$1.A3
ADC1
  Top 0.203: U7.6 47.95,89.84 48.9,88.9 48.9,80.52 50.93,78.49 75.43,78.49 87.05,66.87 87.05,25.42 82.55,20.92 U$1.A2
ADC2
  Top 0.203: U9.6 60.02,89.84 60.96,88.9 60.96,80.64 62.41,79.2 75.86,79.2 87.91,67.15 87.91,23.74 82.55,18.38 U$1.A1
ADC3
  Top 0.203: U8.6 71.07,89.81 71.89,89.81 72.77,88.93 72.77,80.9 73.66,80.01 76.2,80.01 88.66,67.55 88.65,67.55 88.65,21.94 82.55,15.84 U$1.A0
ADC4
  Top 0.203: U12.6 23.82,89.84 24.77,88.9 24.77,81.92 29.49,77.19 74.44,77.19 85.32,66.31 85.32,32.58 83.22,30.48 U$1.A6
ADC5
  Top 0.203: U10.6 11.76,89.84 12.7,88.9 12.7,81.92 18.16,76.45 74.04,76.45 84.45,66.04 84.45,34.92 U$1.A7
GND  (via drill 0.35)
  Top 0.203: v42.93,89.79 42.98,89.84 U7.1 U7.2 | v46.74,85.98 46.67,85.91 C18.2 | U11.2 v31.11,88.9 | U9.2 v54.99,88.9 | U8.2 v67.18,88.9
  Top 0.254: C20.2 10.79,84.78 v10.79,86.36 | U10.2 U10.1 7.29,89.84 v6.99,89.53 | U12.2 U12.1 19.36,89.84 v19.05,89.53 | C22.2 22.54,86.04 v22.86,86.36 | C21.2 34.6,86.04 v34.92,86.36 | U11.2 U11.1 | C19.2 59.05,84.78 v59.05,86.36 | U9.2 U9.1 | C17.2 70.8,86.04 v71.12,86.36 | U8.2 U8.1
  Top 0.406: R15.1 v86.36,3.81
  Top 0.508: 45.94,46.99 U6.1 45.19,47.09 v45.09,46.99 | R11.2 v16.51,17.78 | U1.1 12.17,22.96 v11.94,22.73 | C5.2 v17.78,21.59 | R13.2 v16.51,31.75 | U2.1 12.29,36.93 v12.06,36.7 | C6.2 v17.78,35.56 | U3.1 12.6,50.9 v12.06,51.44 | C7.2 v17.78,49.53 | v23.5,74.93 R8.2 | C1.2 40.96,65.72 v41.27,65.41 | v57.78,74.93 R7.2 | C2.2 v80.01,67.94 | R14.2 v49.53,13.97 | C8.2 v50.8,17.78 | U4.1 45.19,19.15 v45.09,19.05 | R12.2 v49.53,27.94 | U5.1 44.55,33.12 v44.45,33.02 | C9.2 v50.8,31.11 | R10.2 v49.53,41.91 | C10.2 v50.8,45.72 | R9.2 v16.51,45.72 | C13.2 v10.16,29.84 | C11.2 v42.55,52.07 | C16.2 v42.55,26.67 | C12.2 v10.16,26.67 | C14.2 v10.16,55.24 | C15.2 v42.55,12.7
  pour Bottom (isolate 0.254): -8.89,114.3 104.14,114.3 104.14,-8.89 -8.89,-8.89
N$1
  Bottom 0.508: T1.1 PS1.1
N$2
  Top 0.508: T2.1 PS2.1
N$3
  Top 0.203: R1.2 U1.6
N$4  (via drill 0.35)
  Top 0.203: U2.6 12.92,39.37 v11.43,39.37
  Top 0.305: v11.43,41.91 R2.2
  Bottom 0.305: v11.43,39.37 v11.43,41.91
N$5
  Top 0.254: U3.6 R3.2
N$6
  Top 0.508: U4.6 R4.2
N$7
  Top 0.508: R5.2 U5.6
N$8
  Top 0.508: U6.6 R6.2
N$9
  Top 0.508: LED1.C 19.27,74.83 R8.1
N$10
  Top 0.508: LED2.C 53.56,74.83 R7.1
N$11
  Top 0.203: 13.02,48.16 LED6.C
  Top 0.254: R9.1 13.02,48.16
N$12
  Top 0.254: LED3.C 12.92,17.88 R11.1
N$13
  Top 0.508: R14.1 46.04,16.41 LED4.C
N$14
  Top 0.508: R12.1 46.04,30.38 LED7.C
N$15
  Top 0.203: 13.02,34.19 LED5.C
  Top 0.406: R13.1 13.02,34.19
N$16
  Top 0.305: LED8.C 45.94,42.01 R10.1
N$17
  Top 0.508: J5.2 F2.1
N$18
  Top 0.406: U$1.D13 78.83,7.62 76.17,4.95 LED9.A
N$27
  Top 0.406: LED9.C 82.11,3.68 R15.2
PDM1  (via drill 0.35)
  Top 0.254: 40.27,84.45 C18.1 44.77,87.72 U7.3 U7.4
  Top 0.508: U4.2 U4.3 48.04,19.05 48.04,17.78 | 48.04,17.78 LED4.A | 43.81,17.78 33.91,27.69 33.91,53.09 31.75,55.24 31.75,67.94 v38.73,74.93 | 48.04,17.78 43.81,17.78 | 40.27,84.45 R17.1 39.37,83.56 v39.37,78.74 | C15.1 43.81,17.46 43.81,17.78
  Bottom 0.508: v38.73,74.93 39.37,75.56 v39.37,78.74
PDM1_OUT
  Top 0.254: U7.5 46.06,88.9 45.8,89.17 45.8,89.98 45.2,90.57 40.78,90.57 R17.2
  Top 0.508: R17.2 37.05,92.75 36.95,92.75 36.16,93.55 36.16,94.49 35.36,95.29 34.41,95.29 33.66,96.05 33.66,100.33 J2.17
PDM1EN  (via drill 0.35)
  Top 0.203: v53.34,46.99 69.22,46.99 71.25,44.96 71.25,21.72 69.85,20.32 U$1.D7 | U4.5 46.99,20.32 44.45,20.32 40.64,24.13 v40.64,32.64 | v40.64,36.2 40.64,37.47 43.55,40.37 49.26,40.37 51.44,42.55 v51.44,43.81
  Bottom 0.203: v40.64,36.2 v40.64,32.64 | v51.44,43.81 51.44,44.45 53.34,46.35 v53.34,46.99
PDM2  (via drill 0.35)
  Top 0.254: R16.1 64.39,84.45 C17.1 68.9,87.72 U8.3 U8.4
  Top 0.305: U6.3 48.04,46.99 48.04,45.64 LED8.A
  Top 0.508: U6.2 U6.3 | 48.04,45.64 42.55,45.64 | 42.55,45.64 42.15,45.64 38.46,49.33 38.46,55.44 50.96,67.94 55.88,67.94 62.23,74.3 v62.23,74.93 | C11.1 42.55,45.64 | v62.23,80.64 63.5,81.92 63.5,83.56 R16.1
  Bottom 0.508: v62.23,80.64 v62.23,74.93
PDM2_OUT
  Top 0.254: U8.5 70.06,88.9 69.93,89.04 69.93,90.11 69.51,90.53 64.87,90.53 R16.2
  Top 0.508: J2.19 36.2,100.33 40.64,100.33 41.27,99.69 41.27,98.42 41.91,97.79 55.88,97.79 56.52,97.16 56.52,92.71 57.15,92.08 60.59,92.08 62.87,89.8 R16.2
PDM2EN
  Top 0.203: U6.5 46.99,48.26 48.26,48.26 48.9,47.62 48.9,46.35 50.32,44.93 68.01,44.93 69.22,43.73 69.22,26.04 68.58,25.4 U$1.D5
PDM3  (via drill 0.35)
  Top 0.254: R18.1 52.2,84.33 52.33,84.45 C19.1 56.84,87.72 U9.3 U9.4
  Top 0.508: U5.2 U5.3 48.04,33.02 48.04,31.75 | LED7.A 48.04,31.75 | 43.56,31.75 48.04,31.75 | 43.56,31.75 36.91,38.4 36.91,56.59 50.8,70.48 v50.8,74.93 | v51.44,79.38 51.44,83.56 52.2,84.33 | 43.56,31.75 42.55,30.73 C16.1
  Bottom 0.508: v50.8,74.93 51.44,75.56 v51.44,79.38
PDM3_OUT
  Top 0.254: U9.5 58.25,88.9 57.86,89.29 57.86,90.23 57.54,90.56 52.83,90.56 52.26,89.98 R18.2
  Top 0.508: 52.26,89.98 50.44,89.98 48.68,91.74 42.24,91.74 41.24,92.75 41.24,94.49 40.52,95.21 39.41,95.21 38.7,95.92 38.7,97.03 37.98,97.75 36.23,97.75 J2.20
PDM3EN  (via drill 0.35)
  Top 0.203: U5.5 46.99,34.29 45.09,34.29 44.45,34.92 44.45,39.37 44.82,39.74 49.9,39.74 53.34,43.18 v53.34,43.81 | v53.98,45.72 54.23,45.97 68.71,45.97 70.23,44.45 70.23,23.24 69.85,22.86 U$1.D6
  Bottom 0.203: v53.34,43.81 53.34,45.09 v53.98,45.72
PDM4  (via drill 0.35)
  Top 0.254: U3.2 U3.3 | R19.1 4.07,84.45 C20.1 8.33,84.7 U10.3 U10.4
  Top 0.508: U3.3 15.02,50.8 15.02,49.53 | 15.02,49.53 LED6.A | v4.45,49.53 3.43,50.55 3.43,83.81 R19.1 | 15.02,49.53 10.16,49.53 | 10.16,49.53 v8.89,49.53 | C14.1 10.16,49.53
  Bottom 0.508: v8.89,49.53 v4.45,49.53
PDM4_OUT
  Top 0.254: U10.5 9.78,88.9 9.47,89.2 9.47,90.11 9.06,90.53 4.63,90.53 4.54,90.43 4.45,90.43 R19.2
  Top 0.508: R19.2 3.81,97.16 9.74,103.08 27.56,103.08 29.05,101.6 J2.15
PDM4EN  (via drill 0.35)
  Top 0.203: 13.97,52.07 v16.13,52.07 | v28.57,52.07 v20.95,52.07 | v39.62,52.07 40.64,52.07 42.55,53.98 55.24,53.98 60.96,48.26 70.48,48.26 73.66,45.09 73.66,21.59 69.85,17.78 U$1.D8
  Top 0.254: U3.5 13.97,52.07
  Bottom 0.203: v16.13,52.07 v20.95,52.07 | v28.57,52.07 35.56,52.07 v39.62,52.07
PDM5  (via drill 0.35)
  Top 0.254: U11.4 U11.3 32.7,87.72 C21.1 32.45,84.19 R20.1
  Top 0.508: 14.92,35.56 14.92,34.39 LED5.A | 10.16,35.56 9.53,35.56 7.62,37.47 7.62,59.69 8.89,60.96 8.89,76.2 v12.06,79.38 | 10.16,35.56 14.92,35.56 | U2.2 U2.3 14.92,35.56 | C13.1 10.16,35.56 | v17.14,79.38 v24.13,79.38 | v27.94,81.28 R20.1
  Bottom 0.508: v12.06,79.38 v17.14,79.38 | v24.13,79.38 26.04,81.28 v27.94,81.28
PDM5_OUT
  Top 0.254: U11.5 34,88.9 33.6,89.29 33.6,90.11 33.19,90.53 28.67,90.53 R20.2
  Top 0.508: R20.2 27.94,92.87 28.54,93.47 28.54,97.75 J2.16
PDM5EN  (via drill 0.35)
  Top 0.203: U$1.D9 73.03,9.53 73.03,3.17 71.63,1.78 7.75,1.78 4.45,5.08 v4.45,37.47 | U2.5 13.97,40.01 13.46,40.51 v8.89,40.51
  Bottom 0.203: v4.45,37.47 7.49,40.51 v8.89,40.51
PDM6  (via drill 0.35)
  Top 0.254: U12.4 U12.3 20.4,84.7 C22.1 20.38,84.19 R21.1
  Top 0.508: LED3.A 15.02,21.59 | 15.02,21.59 15.02,22.86 U1.3 U1.2 | 10.16,21.59 8.26,21.59 5.71,24.13 5.71,76.83 v10.79,81.92 | 10.16,21.59 15.02,21.59 | v15.24,81.92 15.88,82.55 R21.1 | 10.16,21.59 C12.1
  Bottom 0.508: v10.79,81.92 v15.24,81.92
PDM6_OUT
  Top 0.254: U12.5 21.93,88.9 21.54,89.29 21.54,90.23 21.25,90.53 16.61,90.53 R21.2
  Top 0.508: R21.2 18.16,92.08 25.4,92.08 26.07,92.75 26.07,97.03 27.3,98.26 J2.14
PDM6EN  (via drill 0.35)
  Top 0.203: v36.2,10.16 55.24,10.16 62.61,2.79 70.1,2.79 71.12,3.81 71.12,8.89 U$1.D10 | U1.5 13.97,24.13 15.88,24.13 16.14,23.86 16.14,21.7 27.68,10.16 v32.38,10.16
  Bottom 0.203: v32.38,10.16 v36.2,10.16
SCL  (via drill 0.35)
  Top 0.203: U$1.A5 80.64,27.94 79.63,28.96 79.63,57.63 77.25,60.01 73.88,60.01 72.65,61.24 72.65,73.65 v72.64,73.66 | v76.2,81.28 76.2,90.81 74.74,92.27 67.5,92.27 65.78,93.98 J1.44
  Bottom 0.203: v72.64,73.66 72.64,77.72 v76.2,81.28
SDA  (via drill 0.35)
  Top 0.203: U$1.A4 80.01,25.4 78.64,26.77 78.64,56.64 77.98,57.3 75.69,57.3 74.25,58.74 71.97,58.74 69.85,60.86 v69.85,73.66 | v74.3,81.28 74.3,89.79 72.56,91.53 65.69,91.53 63.24,93.98 J1.42
  Bottom 0.203: v69.85,73.66 69.85,76.83 v74.3,81.28
VIN  (via drill 0.35)
  Top 0.508: PS2.2 33.02,63.5 33.66,64.14 39.05,64.14 C1.1 v39.37,60.96 | PS1.2 75.19,63.82 C2.1 81.28,62.55 81.28,44.45 U$1.RAW | PS1.4 67.94,62.29 66.04,60.38 | 66.04,60.38 D1.C | PS2.3 PS2.4 27.94,60.96 D2.C 25.4,58.13 30.5,53.03 30.48,53.01 D3.C 30.48,13.97 F2.2 | v45.09,60.33 65.98,60.33 66.04,60.38
  Bottom 0.508: PS2.3 PS2.2 | v39.37,60.96 40.01,60.33 v45.09,60.33 | PS1.4 PS1.3 PS1.2

### Text on the board
tDocu: UW AACT | SOC-I | Arduino Nano